# EAGLE design K-Diag small- double (EAGLE 6.5.0)
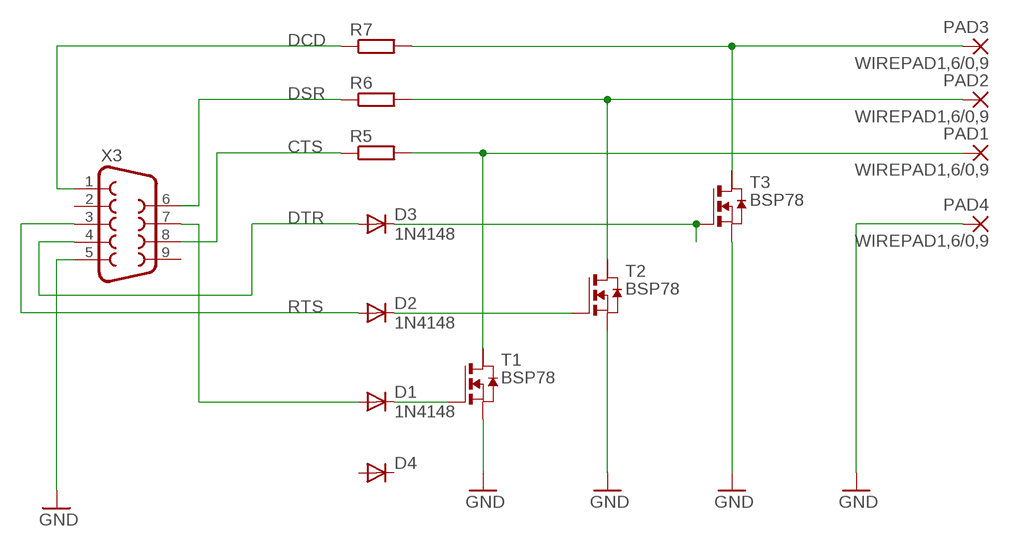
[diagram p0: schematic, sheet 1]

## Parts
D1  1N4148  DIODE-SOD323-W  [SOD323-W]
D2  1N4148  DIODE-SOD323-W  [SOD323-W]
D3  1N4148  DIODE-SOD323-W  [SOD323-W]
D4  DIODE-SOD323-W  [SOD323-W]
PAD1  WIREPAD1,6/0,9  [1,6/0,9]
PAD2  WIREPAD1,6/0,9  [1,6/0,9]
PAD3  WIREPAD1,6/0,9  [1,6/0,9]
PAD4  WIREPAD1,6/0,9  [1,6/0,9]
R5  R-EU_R0805  [R0805]
R6  R-EU_R0805  [R0805]
R7  R-EU_R0805  [R0805]
T1  BSP78  NMOSSOT223  [SOT223]
T2  BSP78  NMOSSOT223  [SOT223]
T3  BSP78  NMOSSOT223  [SOT223]
X3  F09D  [F09D]

## Nets
CTS: R5.1 X3.8
DCD: R7.1 X3.1
DSR: R6.1 X3.6
DTR: D3.A X3.4
GND: PAD4.1(P) T1.3(S) T2.3(S) T3.3(S) X3.5
N$1: D3.C T3.1(G)
N$2: D2.C T2.1(G)
N$3: D1.C T1.1(G)
N$4: PAD1.1(P) R5.2 T1.2(D)
N$5: PAD2.1(P) R6.2 T2.2(D)
N$6: PAD3.1(P) R7.2 T3.2(D)
N$7: D1.A X3.7
RTS: D2.A X3.3
Unconnected: D4.A D4.C T1.4(D2) T2.4(D2) T3.4(D2) X3.2 X3.9

## Library data of the parts
D1-D4 = diode:DIODE-: DIODE
PAD1-PAD4 = wirepad:WIREPAD: Wire PAD connect wire on PCB
R5-R7 = rcl:R-EU_: RESISTOR, European symbol
T1-T3 = zetex:NMOSSOT223: MOS FET
X3 = con-subd:F09: SUB-D; OC_FARNELL: unknown; OC_NEWARK: unknown

## Board
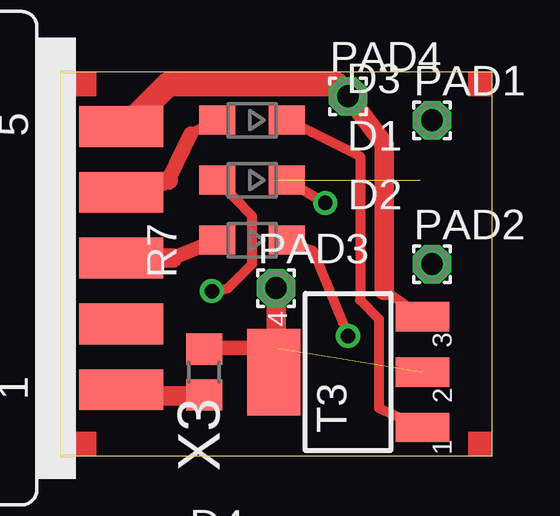
[diagram p1: board, top side]
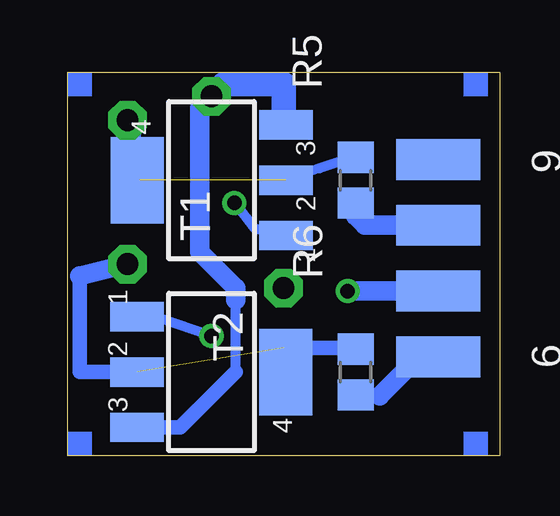
[diagram p2: board, bottom side, seen from below]

Size 18 x 16 mm. Coordinates in mm from the lower left corner, seen from the top.
Outline: 0,0 18,0 18,16 0,16 0,0
Copper layers (1*16): Top 0.035mm / dielectric 1.5mm / Bottom 0.035mm
Design rules "default": minimum track width 10mil, minimum drill 24mil, track to track 8mil, track to pad 8mil, pad to pad 8mil, via to via 8mil, smd to smd 8mil, copper to edge 40mil, drill to drill 8mil, minimum pad ring 10mil, minimum via ring 8mil, stop-mask expansion 4mil, vias tented up to drill 0mil, thermal gap 10mil

### Footprints (pad centres in the part's own frame; a part is rotated, then mirrored left to right if it is on the bottom)
SOD323-W = smd 1.5 x 1.2: A 1.45,0; C -1.45,0
1,6/0,9 = drill 0.914 pad 1.6 octagon: 1 0,0
R0805 = smd 1.3 x 1.5: 1 -0.95,0; 2 0.95,0
SOT223 = smd 1.219 x 2.235: 1 -2.311,-3.099; 2 0,-3.099; 3 2.311,-3.099 | smd 3.6 x 2.2: 4 0,3.099
F09D = smd 1.7 x 3.5: 1 -5.486,-6.045; 2 -2.743,-6.045; 3 0,-6.045; 4 2.743,-6.045; 5 5.486,-6.045 | smd 1.7 x 3.5 bottom: 6 -4.115,-6.045; 7 -1.372,-6.045; 8 1.372,-6.045; 9 4.115,-6.045

### Placement (x,y rotation side)
D1  8,11.5 180 top
D2  8,9 180 top
D3  8,14 180 top
D4  6.5,-4.5 0 top  (outside the outline)
PAD1  15.5,14 0 top
PAD2  15.5,8 0 top
PAD3  9,7 0 top
PAD4  12,15 0 top
R5  6,11.5 90 bottom
R6  6,3.5 90 bottom
R7  6,3.5 90 top
T1  12,11.5 90 bottom
T2  12,3.5 270 bottom
T3  12,3.5 90 top
X3  -3.5,8.25 90 top

### Tracks (layer width: path | path; a pad name or v marks a point on that pad's centre or on a via)
CTS
  Bottom 0.61: 6,10 R5.1
  Bottom 0.813: X3.8 5.62,9.62 6,10
DCD
  Top 0.406: 2.78,3 X3.1
  Top 0.61: R7.1 6,2.5
  Top 0.813: 6,2.5 4,2.5 2.78,3
DSR
  Bottom 0.61: 5,2.5 R6.1
  Bottom 0.813: X3.6 3.37,4.13 5,2.5
DTR
  Top 0.406: D3.A 5.45,13.45 | 2.55,11 X3.4
  Top 0.61: 5.45,13.45 4.5,11.5
  Top 0.813: 4.5,11.5 2.55,11
GND
  Top 0.406: X3.5 3.24,13.74 | T3.3 13.5,6.9
  Top 0.813: 13.5,6.9 13.5,13 PAD4.1
  Top 1.016: 3.24,13.74 3.24,14.24 4.5,15.5 11.5,15.5 PAD4.1
  Bottom 0.406: 11,3.5 11,6.5
  Bottom 0.61: T2.3 13.31,1.19 11,3.5
  Bottom 0.813: 11,6.5 11,7 12.5,8.5 12.5,14.5 PAD4.1
  Bottom 1.016: T1.3 9,13.81 9,15.5 11.5,15.5 PAD4.1
N$1
  Top 0.406: D3.C 10.5,13.5 12.5,12.5 12.5,6.5 13.29,5.71 13.29,2 T3.1
N$2  (via drill 0.6)
  Top 0.406: D2.C 10.55,8.55 v12,5
  Bottom 0.406: v12,5 14.91,6 T2.1
N$3  (via drill 0.6)
  Top 0.406: D1.C v11.05,10.55
  Bottom 0.406: v11.05,10.55 11,10.5 10.21,9.5 T1.1
N$4  (1 unrouted)
  Bottom 0.406: R5.2 6,12.5 7.5,12 T1.2
  Bottom 0.813: 15,11.5 PAD1.1
N$5  (1 unrouted)
  Bottom 0.406: R6.2 6,4.5
  Bottom 0.61: 6,4.5 9,4.5 | 17.5,7.5 17.5,3.5 T2.2
  Bottom 0.813: PAD2.1 17.5,7.5
N$6  (1 unrouted)
  Top 0.406: R7.2 6,4.5
  Top 0.61: 6,4.5 9,4.5
  Top 0.813: PAD3.1 9,4.5
N$7  (via drill 0.6)
  Top 0.406: v6.33,6.88 6.5,6.88 7,7 8,8 8,10 D1.A
  Bottom 0.813: X3.7 v6.33,6.88
RTS
  Top 0.61: 4.7,8.25 D2.A
  Top 0.813: X3.3 4.7,8.25
(copper drawn outside any net)
  shapes: Bottom area x4, Top area x4